# EAGLE schematic v1 (EAGLE 7.7.0)
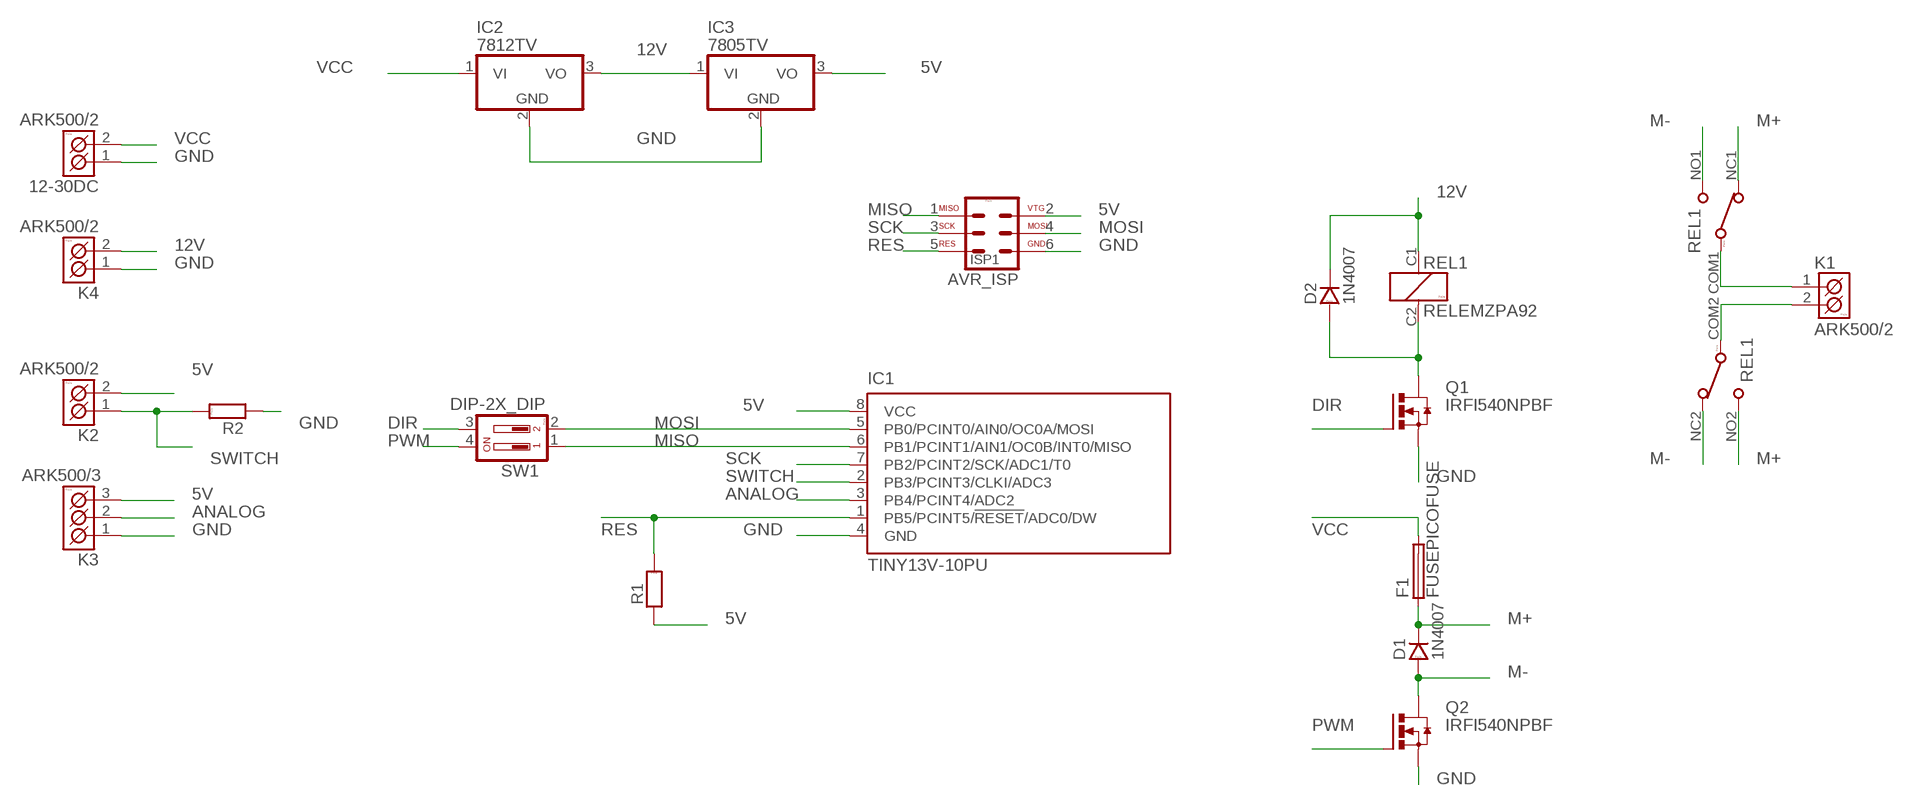
[diagram p0: schematic, sheet 1]

## Parts
12-30DC  ARK500/2  [ARK500/2]
D1  1N4007  [DO41]
D2  1N4007  [DO41]
F1  FUSEPICOFUSE  [PICOFUSE]
IC1  TINY13V-10PU  [DIL08]
IC2  7812TV  [TO220V]
IC3  7805TV  [TO220V]
ISP1  AVR_ISP  [MLW06G]
K1  ARK500/2  [ARK500/2]
K2  ARK500/2  [ARK500/2]
K3  ARK500/3  [ARK500/3]
K4  ARK500/2  [ARK500/2]
Q1  IRFI540NPBF  [TO220BH]
Q2  IRFI540NPBF  [TO220BH]
R1  R_7,5  [R-7,5]
R2  R_7,5  [R-7,5]
REL1  RELEMZPA92  [RELEMZPA92]
SW1  DIP-2X_DIP  [DIP-2X]

## Nets
5V: IC1.8(VCC) IC3.3(VO) ISP1.2 K2.2(K2) K3.3(K3) R1.1
12V: D2.K IC2.3(VO) IC3.1(VI) K4.2(K2) REL1.C1(CIVKA:C1)
ANALOG: IC1.3(PB4/PCINT4/ADC2) K3.2(K2)
DIR: Q1.G SW1.3
GND: 12-30DC.1(K1) IC1.4(GND) IC2.2(GND) IC3.2(GND) ISP1.6 K3.1(K1) K4.1(K1) Q1.S Q2.S R2.1
M+: D1.K F1.1 REL1.NC1(PREP1:NC) REL1.NO2(PREP2:NO)
M-: D1.A Q2.D REL1.NC2(PREP2:NC) REL1.NO1(PREP1:NO)
MISO: IC1.6(PB1/PCINT1/AIN1/OC0B/INT0/MISO) ISP1.1 SW1.1
MOSI: IC1.5(PB0/PCINT0/AIN0/OC0A/MOSI) ISP1.4 SW1.2
N$1: K1.2(K2) REL1.COM2(PREP2:COM)
N$2: K1.1(K1) REL1.COM1(PREP1:COM)
N$3: D2.A Q1.D REL1.C2(CIVKA:C2)
PWM: Q2.G SW1.4
RES: IC1.1(PB5/PCINT5/!RESET!/ADC0/DW) ISP1.5 R1.2
SCK: IC1.7(PB2/PCINT2/SCK/ADC1/T0) ISP1.3
SWITCH: IC1.2(PB3/PCINT3/CLKI/ADC3) K2.1(K1) R2.2
VCC: 12-30DC.2(K2) F1.2 IC2.1(VI)

## Library data of the parts
12-30DC K1 K2 K4 = #PaJa_konektory:ARK500/2: Svorkovnice - roztec 5mm - dvojita
D1 D2 = #PaJa_31:1N4007: Usmernovaci dioda - 1A, 1000V
F1 = fuse:FUSE: Fuse; OC_FARNELL: unknown; OC_NEWARK: unknown
IC1 = atmel:TINY13: 8-bit AVR Microcontroller with 1K Bytes In-System Programmable Flash Source: http://www.atmel.com/dyn/resources/prod_documents/2535S.pdf; MPN: ATTINY13V-10PU; OC_FARNELL: 9171576; OC_NEWARK: 96K6523
IC2 IC3 = linear:78*: Positive VOLTAGE REGULATOR Source: http://cache.national.com/ds/LM/LM78L05.pdf http://www.fairchildsemi.com/ds/LM/LM7805.pdf
ISP1 = #PaJa_31:AVR_ISP: AVR ISP konektor (dle standardu)
K3 = #PaJa_konektory:ARK500/3: Svorkovnice - roztec 5mm - trojita
Q1 Q2 = transistor-power:IRFI540NPBF: HEXFET Power MOISFET VDSS = 100V, RDS(on) = 0.052 Ohm, ID = 20A, VGS(th) = 2.0 -- 4.0V Source: http://www.irf.com/product-info/datasheets/data/irfi540npbf.pdf
R1 R2 = #PaJa_31:R: Rezistor
REL1 = #PaJa_31:RELEMZPA92: RELE - 2x prepinaci, 5V, 12V, 24V max. spinany proud = 5A stejna roztec noh, rozmery (mimo vysku) a zapojeni jako rele RELE4061, RELEF4052 a RELEF4152
SW1 = #PaJa_prepinace:DIP-2X: DIP Prepinac - 2x